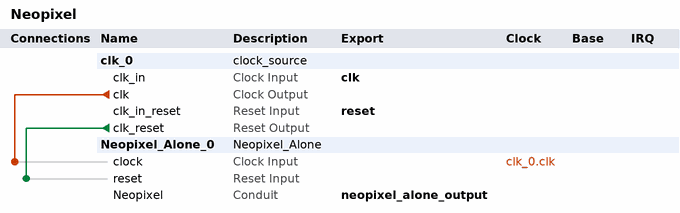
[diagram p0: system contents]
# Platform Designer (Qsys) system Neopixel, MAX 10 10M50DAF484C6GES
# Parameters at their usual value, and those the tool derives, are not listed.
package require -exact qsys 18.1
create_system Neopixel
set_project_property DEVICE_FAMILY {MAX 10}
set_project_property DEVICE 10M50DAF484C6GES

add_instance clk_0 clock_source 18.1
set_instance_parameter_value clk_0 clockFrequency 50000000

add_instance Neopixel_Alone_0 Neopixel_Alone 1.50.8

# connections
add_connection clk_0.clk Neopixel_Alone_0.clock clock
add_connection clk_0.clk_reset Neopixel_Alone_0.reset reset

# exported interfaces
add_interface clk clock sink
set_interface_property clk EXPORT_OF clk_0.clk_in
add_interface neopixel_alone_output conduit end
set_interface_property neopixel_alone_output EXPORT_OF Neopixel_Alone_0.Neopixel
add_interface reset reset sink
set_interface_property reset EXPORT_OF clk_0.clk_in_reset

set_interconnect_requirement {$system} qsys_mm.clockCrossingAdapter HANDSHAKE
set_interconnect_requirement {$system} qsys_mm.enableEccProtection FALSE
set_interconnect_requirement {$system} qsys_mm.insertDefaultSlave FALSE
set_interconnect_requirement {$system} qsys_mm.maxAdditionalLatency 1

save_system Neopixel.qsys
